# Altium schematic sheet 主控原理图.SchDoc
size A4
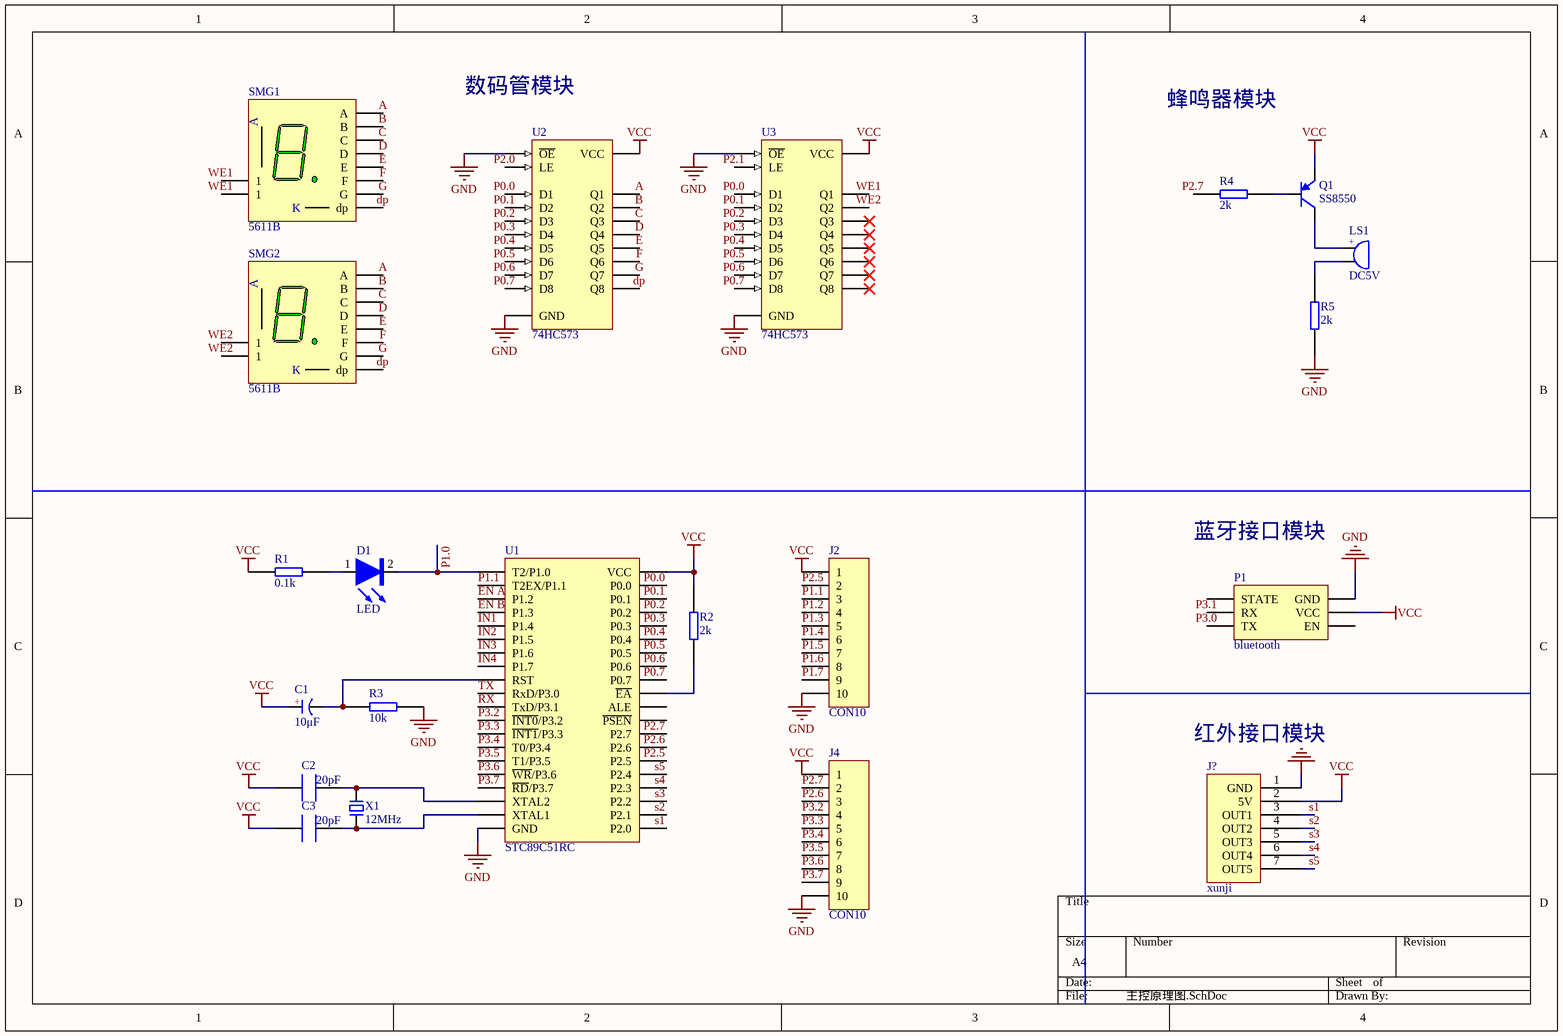
[diagram p0: 主控原理图.SchDoc]

## Parts
C1  10μF
C2  20pF  [0805C]
C3  20pF  [0805C]
D1  LED  [0805D]
J2  CON10
J4  CON10
J?  xunji
LS1  DC5V  [BEEP 5x9x5.5]
P1  bluetooth
Q1  SS8550  [SOT23-3N]
R1  0.1k  [0805R]
R2  2k  [0805R]
R3  10k  [0805R]
R4  2k  [0805R]
R5  2k  [0805R]
SMG1  5611B  [SMG 0.56-1P]
SMG2  5611B  [SMG 0.56-1P]
U1  STC89C51RC  [DIP40-600]
U2  74HC573  [SOP20_L]
U3  74HC573  [SOP20_L]
X1  12MHz  [OSC HC-49S]

## Nets
GND: J2.10 J4.10 J?.1(GND) P1.4(GND) R3.1 R5.1 U1.20(GND) U2.1(~{OE}) U2.10(GND) U3.1(~{OE}) U3.10(GND)
VCC: C1.1(A) C2.2 C3.1 J2.1 J4.1 J?.2(5V) P1.5(VCC) Q1.2(E) R1.2 R2.2 U1.40(VCC) U2.20(VCC) U3.20(VCC)
A: SMG1.7(A) SMG2.7(A) U2.19(Q1)
B: SMG1.6(B) SMG2.6(B) U2.18(Q2)
C: SMG1.4(C) SMG2.4(C) U2.17(Q3)
D: SMG1.2(D) SMG2.2(D) U2.16(Q4)
dp: SMG1.5(dp) SMG2.5(dp) U2.12(Q8)
E: SMG1.1(E) SMG2.1(E) U2.15(Q5)
EN A: U1.3(P1.2)
EN B: U1.4(P1.3)
F: SMG1.9(F) SMG2.9(F) U2.14(Q6)
G: SMG1.10(G) SMG2.10(G) U2.13(Q7)
IN1: U1.5(P1.4)
IN2: U1.6(P1.5)
IN3: U1.7(P1.6)
IN4: U1.8(P1.7)
P0.0: U1.39(P0.0) U2.2(D1) U3.2(D1)
P0.1: U1.38(P0.1) U2.3(D2) U3.3(D2)
P0.2: U1.37(P0.2) U2.4(D3) U3.4(D3)
P0.3: U1.36(P0.3) U2.5(D4) U3.5(D4)
P0.4: U1.35(P0.4) U2.6(D5) U3.6(D5)
P0.5: U1.34(P0.5) U2.7(D6) U3.7(D6)
P0.6: U1.33(P0.6) U2.8(D7) U3.8(D7)
P0.7: U1.32(P0.7) U2.9(D8) U3.9(D8)
P1.0: D1.2 U1.1(T2/P1.0)
P1.1: J2.3 U1.2(T2EX/P1.1)
P1.2: J2.4
P1.3: J2.5
P1.4: J2.6
P1.5: J2.7
P1.6: J2.8
P1.7: J2.9
P2.0: U2.11(LE)
P2.1: U3.11(LE)
P2.5: J2.2 U1.26(P2.5)
P2.6: J4.3 U1.27(P2.6)
P2.7: J4.2 R4.2 U1.28(P2.7)
P3.0: P1.3(TX)
P3.1: P1.2(RX)
P3.2: J4.4 U1.12(~{INT0}/P3.2)
P3.3: J4.5 U1.13(~{INT1}/P3.3)
P3.4: J4.6 U1.14(T0/P3.4)
P3.5: J4.7 U1.15(T1/P3.5)
P3.6: J4.8 U1.16(~{WR}/P3.6)
P3.7: J4.9 U1.17(~{RD}/P3.7)
RX: U1.11(TxD/P3.1)
s1: J?.3(OUT1) U1.21(P2.0)
s2: J?.4(OUT2) U1.22(P2.1)
s3: J?.5(OUT3) U1.23(P2.2)
s4: J?.6(OUT4) U1.24(P2.3)
s5: J?.7(OUT5) U1.25(P2.4)
TX: U1.10(RxD/P3.0)
WE1: SMG1.3(1) SMG1.8(1) U3.19(Q1)
WE2: SMG2.3(1) SMG2.8(1) U3.18(Q2)
NetC1_2: C1.2(K) R3.2 U1.9(RST)
NetC2_1: C2.1 U1.18(XTAL2) X1.1
NetC3_2: C3.2 U1.19(XTAL1) X1.2
NetD1_1: D1.1 R1.1
NetLS1_1: LS1.1 Q1.3(C)
NetLS1_2: LS1.2 R5.2
NetQ1_1: Q1.1(B) R4.1
NetR2_1: R2.1 U1.31(~{EA})

Not connected (* = marked no-connect by the designer): P1 1(STATE) 6(EN); U1 29(~{PSEN}) 30(ALE); U3 12(Q8)* 13(Q7)* 14(Q6)* 15(Q5)* 16(Q4)* 17(Q3)*

## Notes on the sheet
- 数码管模块
- 蜂鸣器模块
- 蓝牙接口模块
- (near J?) 红外接口模块
- (in symbol 5611B) K
- (in symbol BEEP) +
- (in symbol 极性电容) +

## Library data of the parts
C1 = 极性电容
C2 C3 = CAP: 电容
J2 J4 = CON10: Connector
J? = 五路红外循迹
LS1 = BEEP: 蜂鸣器; 版权归属: 源创客; BOM名称: 蜂鸣器; 学习资源: www.ooocke.com
Q1 = 8550-SMD: 高频放大-PNP型; 版权归属: 源创客; 属性: 40V 1.5A 1W 100MHZ; BOM名称: 高频放大-PNP型; 学习资源: www.ooocke.com
R1-R5 = RES: 电阻
SMG1 SMG2 = 5611B: 0.56寸1位共阳数码管; 版权归属: 源创客; BOM名称: 0.56寸1位共阳; 学习资源: www.ooocke.com
U1 = STC89C51RC: STC单片机; 版权归属: 源创客; BOM名称: STC单片机; 学习资源: www.ooocke.com
U2 U3 = 74HC573: D类三态输出锁存器; 版权归属: 源创客; BOM名称: 三态输出锁存器; 学习资源: www.ooocke.com
X1 = XTAL-2P: 2脚无源脚晶振; 版权归属: 源创客; BOM名称: 2脚无源脚晶振; 学习资源: www.ooocke.com